# EAGLE design serializer (EAGLE 6.6.0)
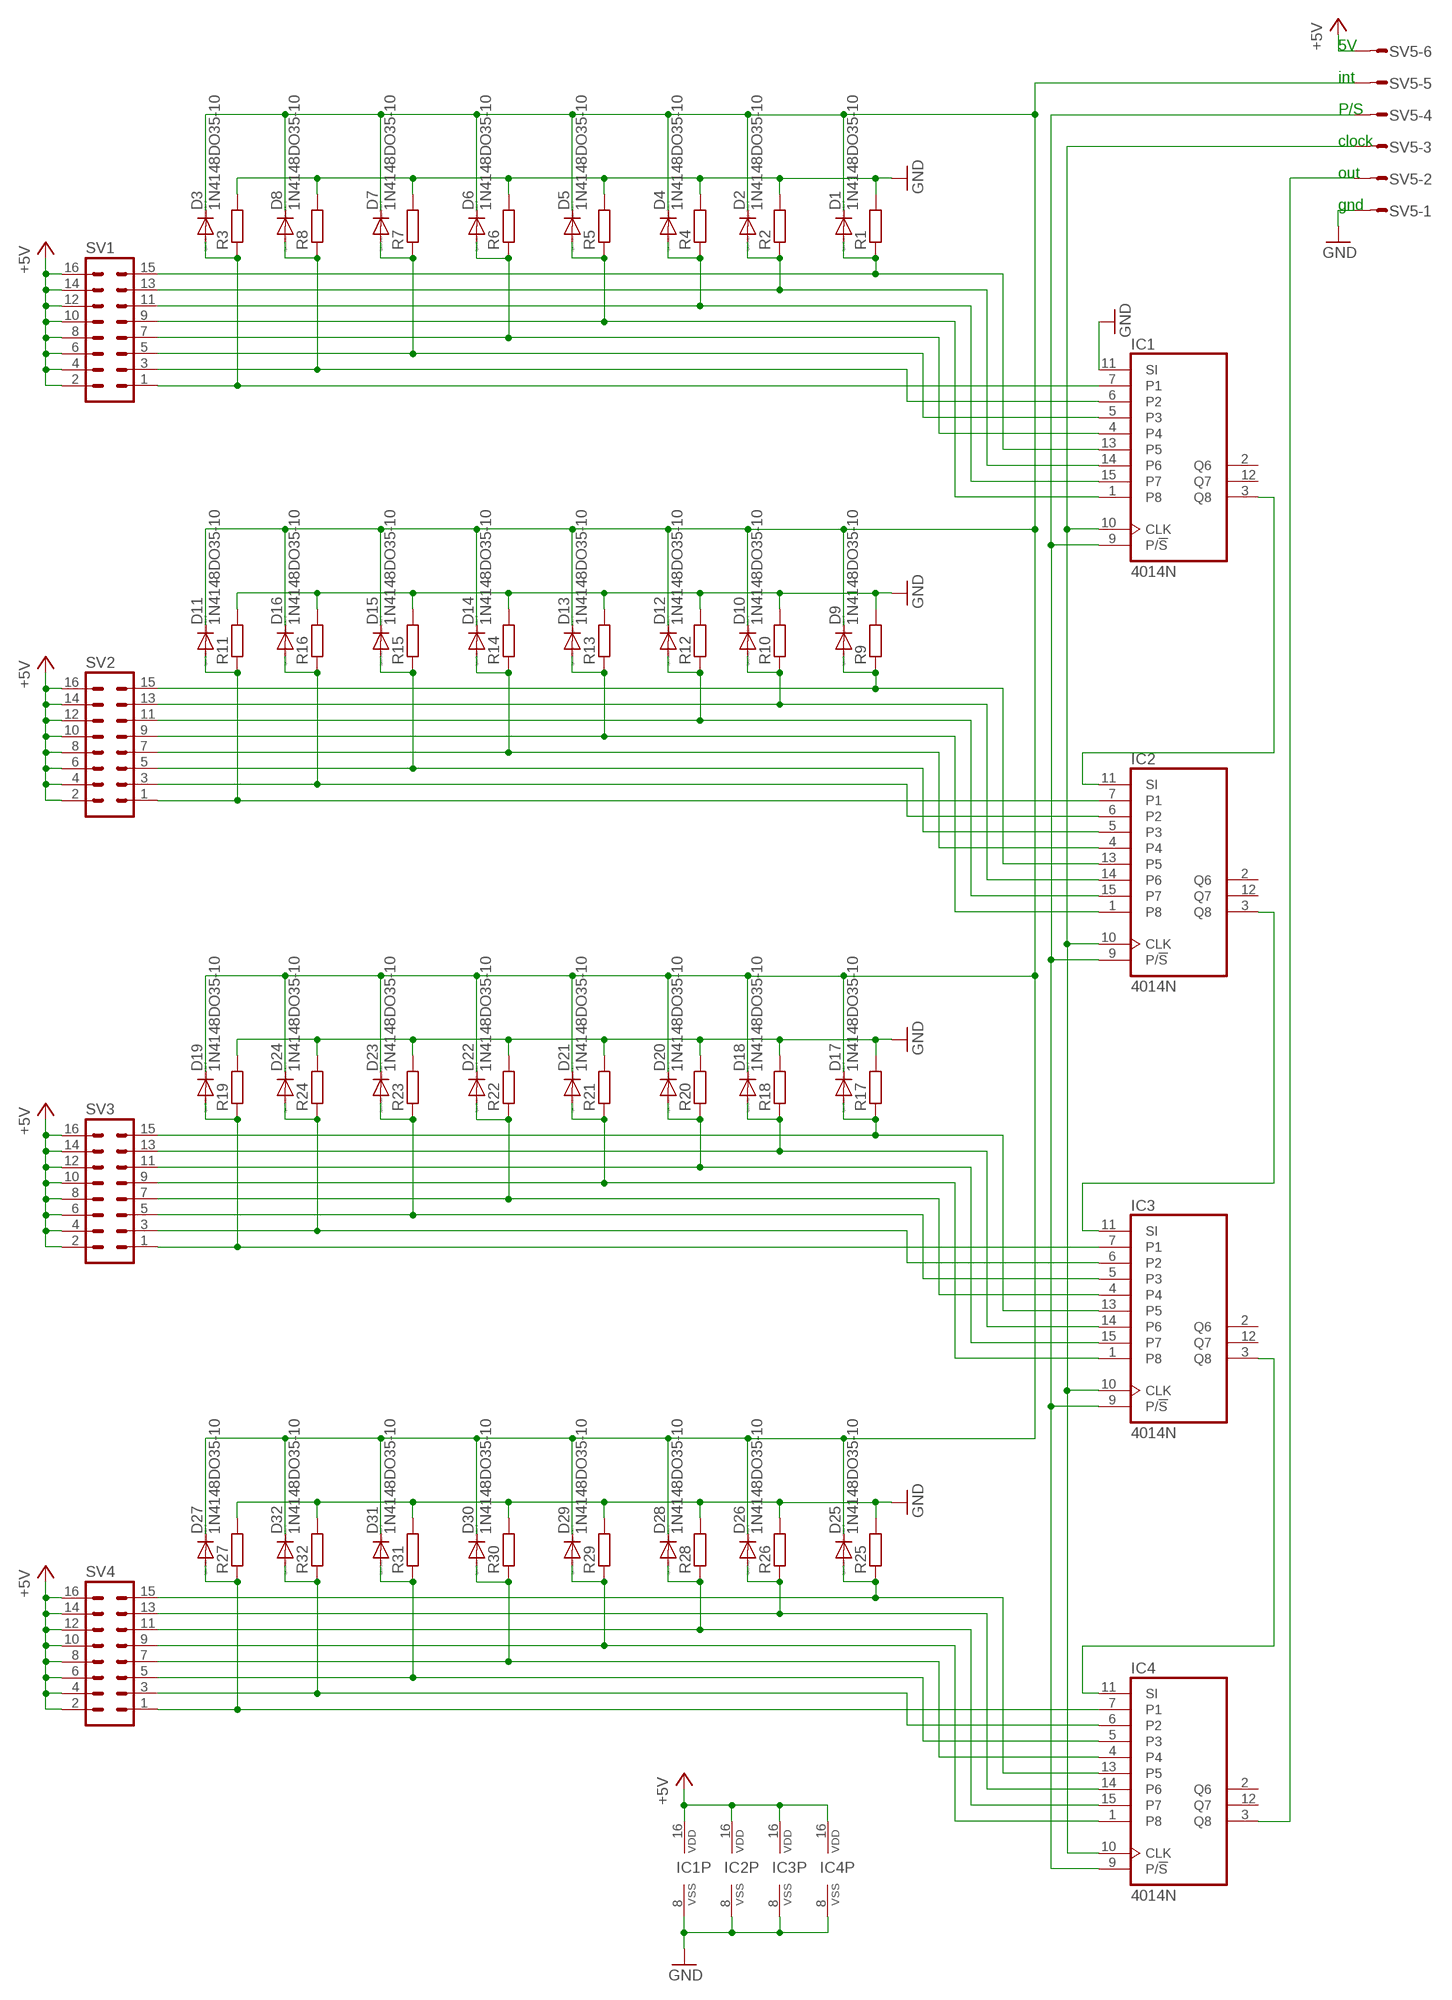
[diagram p0: schematic, sheet 1]

## Parts
D1  1N4148DO35-10  [DO35-10]
D2  1N4148DO35-10  [DO35-10]
D3  1N4148DO35-10  [DO35-10]
D4  1N4148DO35-10  [DO35-10]
D5  1N4148DO35-10  [DO35-10]
D6  1N4148DO35-10  [DO35-10]
D7  1N4148DO35-10  [DO35-10]
D8  1N4148DO35-10  [DO35-10]
D9  1N4148DO35-10  [DO35-10]
D10  1N4148DO35-10  [DO35-10]
D11  1N4148DO35-10  [DO35-10]
D12  1N4148DO35-10  [DO35-10]
D13  1N4148DO35-10  [DO35-10]
D14  1N4148DO35-10  [DO35-10]
D15  1N4148DO35-10  [DO35-10]
D16  1N4148DO35-10  [DO35-10]
D17  1N4148DO35-10  [DO35-10]
D18  1N4148DO35-10  [DO35-10]
D19  1N4148DO35-10  [DO35-10]
D20  1N4148DO35-10  [DO35-10]
D21  1N4148DO35-10  [DO35-10]
D22  1N4148DO35-10  [DO35-10]
D23  1N4148DO35-10  [DO35-10]
D24  1N4148DO35-10  [DO35-10]
D25  1N4148DO35-10  [DO35-10]
D26  1N4148DO35-10  [DO35-10]
D27  1N4148DO35-10  [DO35-10]
D28  1N4148DO35-10  [DO35-10]
D29  1N4148DO35-10  [DO35-10]
D30  1N4148DO35-10  [DO35-10]
D31  1N4148DO35-10  [DO35-10]
D32  1N4148DO35-10  [DO35-10]
IC1  4014N  [DIL16]
IC2  4014N  [DIL16]
IC3  4014N  [DIL16]
IC4  4014N  [DIL16]
R1  R-EU_M1206  [M1206]
R2  R-EU_M1206  [M1206]
R3  R-EU_M1206  [M1206]
R4  R-EU_M1206  [M1206]
R5  R-EU_M1206  [M1206]
R6  R-EU_M1206  [M1206]
R7  R-EU_M1206  [M1206]
R8  R-EU_M1206  [M1206]
R9  R-EU_M1206  [M1206]
R10  R-EU_M1206  [M1206]
R11  R-EU_M1206  [M1206]
R12  R-EU_M1206  [M1206]
R13  R-EU_M1206  [M1206]
R14  R-EU_M1206  [M1206]
R15  R-EU_M1206  [M1206]
R16  R-EU_M1206  [M1206]
R17  R-EU_M1206  [M1206]
R18  R-EU_M1206  [M1206]
R19  R-EU_M1206  [M1206]
R20  R-EU_M1206  [M1206]
R21  R-EU_M1206  [M1206]
R22  R-EU_M1206  [M1206]
R23  R-EU_M1206  [M1206]
R24  R-EU_M1206  [M1206]
R25  R-EU_M1206  [M1206]
R26  R-EU_M1206  [M1206]
R27  R-EU_M1206  [M1206]
R28  R-EU_M1206  [M1206]
R29  R-EU_M1206  [M1206]
R30  R-EU_M1206  [M1206]
R31  R-EU_M1206  [M1206]
R32  R-EU_M1206  [M1206]
SV1  MA08-2  [MA08-2]
SV2  MA08-2  [MA08-2]
SV3  MA08-2  [MA08-2]
SV4  MA08-2  [MA08-2]
SV5  S06P  [S06P]

## Nets
+5V: IC1.16(VDD) IC2.16(VDD) IC3.16(VDD) IC4.16(VDD) SV1.2 SV1.4 SV1.6 SV1.8 SV1.10 SV1.12 SV1.14 SV1.16 SV2.2 SV2.4 SV2.6 SV2.8 SV2.10 SV2.12 SV2.14 SV2.16 SV3.2 SV3.4 SV3.6 SV3.8 SV3.10 SV3.12 SV3.14 SV3.16 SV4.2 SV4.4 SV4.6 SV4.8 SV4.10 SV4.12 SV4.14 SV4.16 SV5.6
GND: IC1.8(VSS) IC1.11(SI) IC2.8(VSS) IC3.8(VSS) IC4.8(VSS) R1.2 R2.2 R3.2 R4.2 R5.2 R6.2 R7.2 R8.2 R9.2 R10.2 R11.2 R12.2 R13.2 R14.2 R15.2 R16.2 R17.2 R18.2 R19.2 R20.2 R21.2 R22.2 R23.2 R24.2 R25.2 R26.2 R27.2 R28.2 R29.2 R30.2 R31.2 R32.2 SV5.1
N$1: D1.A IC1.13(P5) R1.1 SV1.15
N$2: D2.A IC1.14(P6) R2.1 SV1.13
N$3: D9.A IC2.13(P5) R9.1 SV2.15
N$4: D10.A IC2.14(P6) R10.1 SV2.13
N$6: D11.A IC2.7(P1) R11.1 SV2.1
N$7: D12.A IC2.15(P7) R12.1 SV2.11
N$8: D13.A IC2.1(P8) R13.1 SV2.9
N$9: D14.A IC2.4 R14.1 SV2.7
N$10: D15.A IC2.5(P3) R15.1 SV2.5
N$11: D16.A IC2.6(P2) R16.1 SV2.3
N$12: IC2.3(Q8) IC3.11(SI)
N$13: IC1.10(CLK) IC2.10(CLK) IC3.10(CLK) IC4.10(CLK) SV5.3
N$15: D17.A IC3.13(P5) R17.1 SV3.15
N$16: D18.A IC3.14(P6) R18.1 SV3.13
N$17: D1.C D2.C D3.C D4.C D5.C D6.C D7.C D8.C D9.C D10.C D11.C D12.C D13.C D14.C D15.C D16.C D17.C D18.C D19.C D20.C D21.C D22.C D23.C D24.C D25.C D26.C D27.C D28.C D29.C D30.C D31.C D32.C SV5.5
N$18: D19.A IC3.7(P1) R19.1 SV3.1
N$19: D20.A IC3.15(P7) R20.1 SV3.11
N$20: D21.A IC3.1(P8) R21.1 SV3.9
N$21: D22.A IC3.4 R22.1 SV3.7
N$22: D23.A IC3.5(P3) R23.1 SV3.5
N$23: D24.A IC3.6(P2) R24.1 SV3.3
N$24: IC3.3(Q8) IC4.11(SI)
N$27: D25.A IC4.13(P5) R25.1 SV4.15
N$28: D26.A IC4.14(P6) R26.1 SV4.13
N$30: D27.A IC4.7(P1) R27.1 SV4.1
N$31: D28.A IC4.15(P7) R28.1 SV4.11
N$32: D29.A IC4.1(P8) R29.1 SV4.9
N$33: D30.A IC4.4 R30.1 SV4.7
N$34: D31.A IC4.5(P3) R31.1 SV4.5
N$35: D32.A IC4.6(P2) R32.1 SV4.3
N$36: IC4.3(Q8) SV5.2
N$39: D3.A IC1.7(P1) R3.1 SV1.1
N$40: IC1.9(P/!S) IC2.9(P/!S) IC3.9(P/!S) IC4.9(P/!S) SV5.4
N$41: D4.A IC1.15(P7) R4.1 SV1.11
N$43: D5.A IC1.1(P8) R5.1 SV1.9
N$45: D6.A IC1.4 R6.1 SV1.7
N$47: D7.A IC1.5(P3) R7.1 SV1.5
N$49: D8.A IC1.6(P2) R8.1 SV1.3
N$51: IC1.3(Q8) IC2.11(SI)
Unconnected: IC1.2(Q6) IC1.12(Q7) IC2.2(Q6) IC2.12(Q7) IC3.2(Q6) IC3.12(Q7) IC4.2(Q6) IC4.12(Q7)

## Notes on the sheet
- 5V
- int
- P/S
- clock
- out
- gnd

## Library data of the parts
D1-D32 = diode:1N4148: DIODE high speed (Philips)
IC1-IC4 = 40xx:4014: 8-bit static SHIFT REGISTER
R1-R32 = resistor:R-EU_: RESISTOR, European symbol
SV1-SV4 = con-lstb:MA08-2: PIN HEADER; OC_FARNELL: unknown; OC_NEWARK: unknown
SV5 = con-amp-mt:S06P: AMP MT CONNECTOR; OC_FARNELL: unknown; OC_NEWARK: unknown

## Board
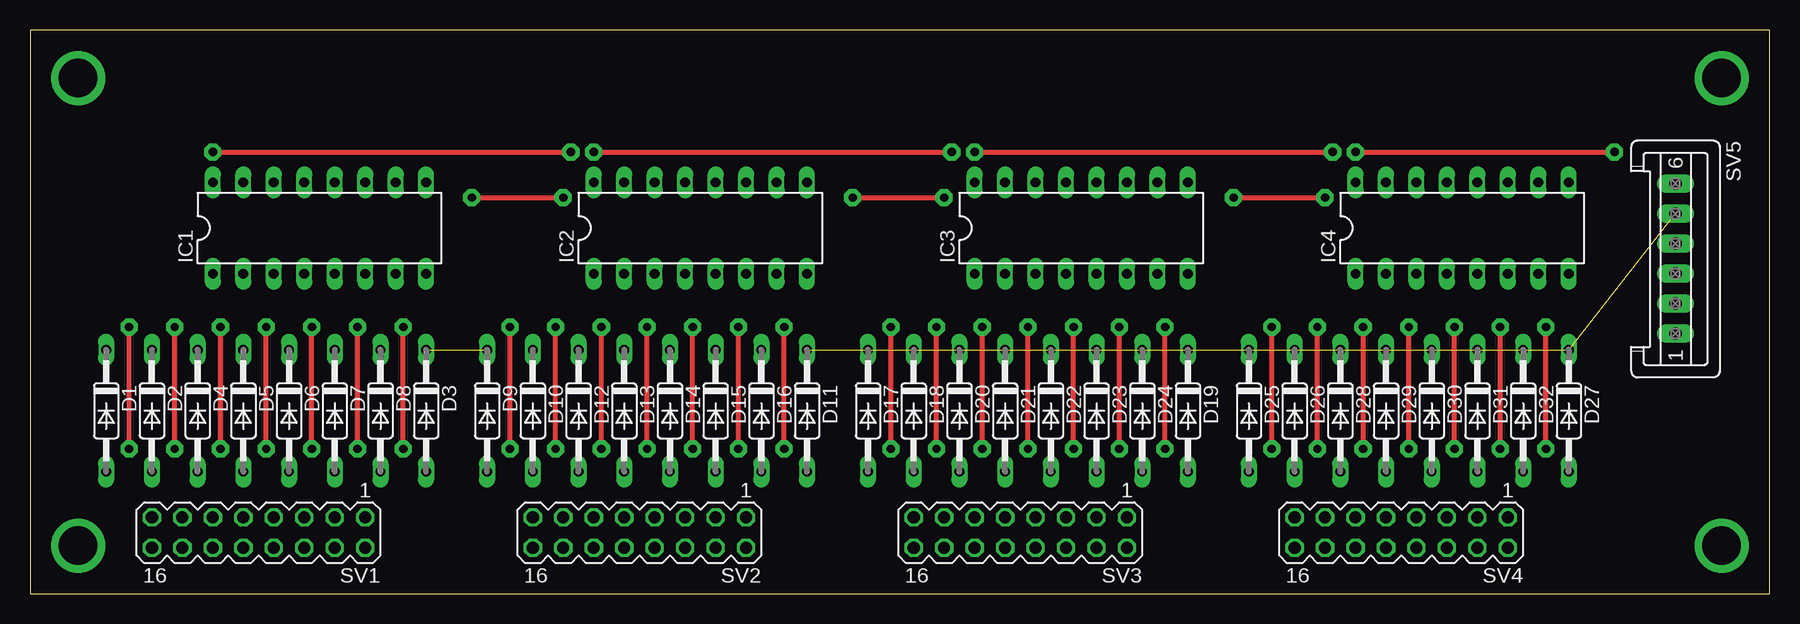
[diagram p1: board, top side]
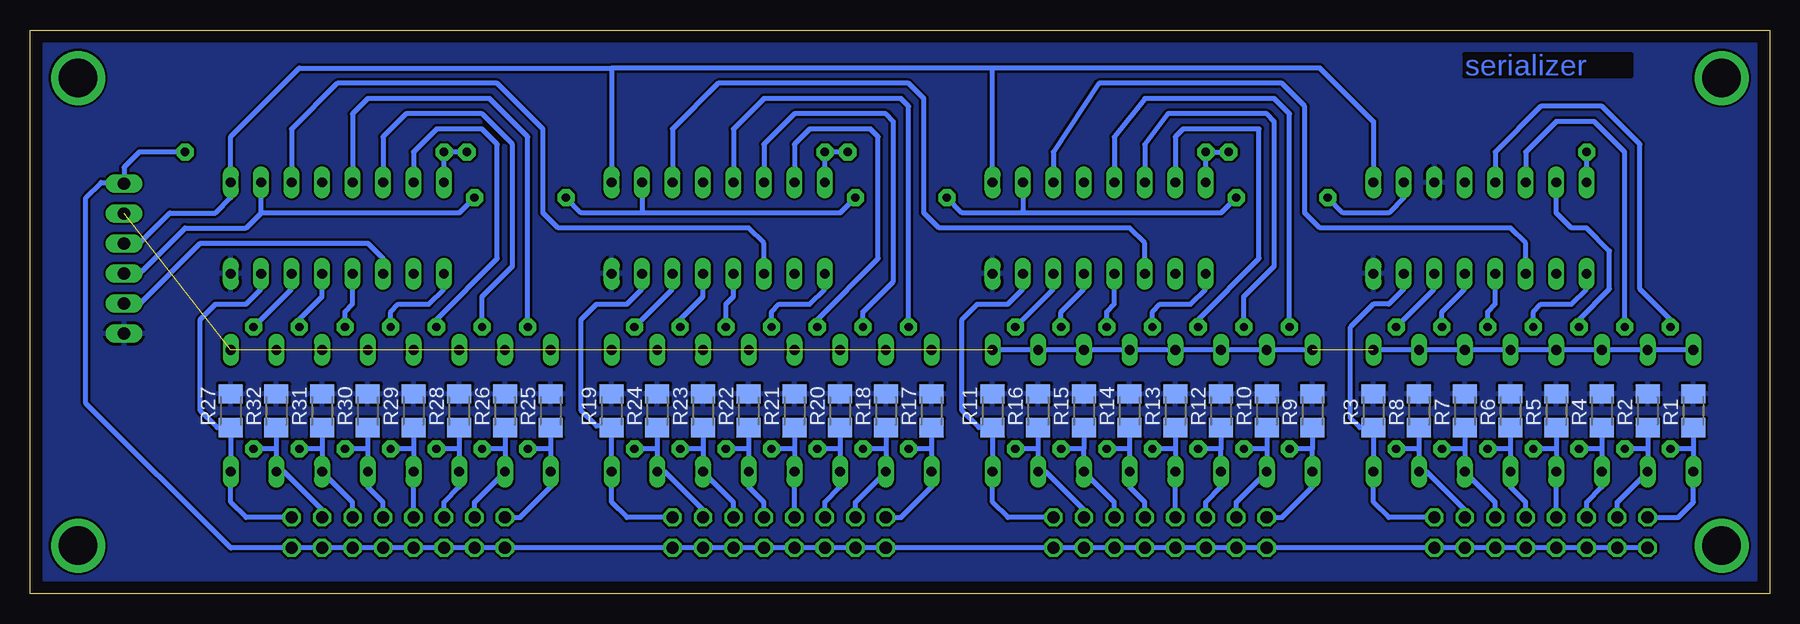
[diagram p2: board, bottom side, seen from below]

Size 145 x 47 mm. Coordinates in mm from the lower left corner, seen from the top.
Outline: 0,0 145,0 145,47 0,47 0,0
Copper layers (1*16): Top 0.035mm / dielectric 1.5mm / Bottom 0.035mm
Design rules "default": minimum track width 10mil, minimum drill 24mil, track to track 8mil, track to pad 8mil, pad to pad 8mil, via to via 8mil, smd to smd 8mil, copper to edge 40mil, drill to drill 8mil, minimum pad ring 10mil, minimum via ring 8mil, stop-mask expansion 4mil, vias tented up to drill 0mil, thermal gap 10mil

### Footprints (pad centres in the part's own frame; a part is rotated, then mirrored left to right if it is on the bottom)
DO35-10 = drill 0.813 long: A 5.08,0; C -5.08,0
DIL16 = drill 0.813 long: 1 -8.89,-3.81; 2 -6.35,-3.81; 3 -3.81,-3.81; 4 -1.27,-3.81; 5 1.27,-3.81; 6 3.81,-3.81; 7 6.35,-3.81; 8 8.89,-3.81; 9 8.89,3.81; 10 6.35,3.81; 11 3.81,3.81; 12 1.27,3.81; 13 -1.27,3.81; 14 -3.81,3.81; 15 -6.35,3.81; 16 -8.89,3.81
M1206 = smd 1.6 x 2: 1 -1.4,0; 2 1.4,0
MA08-2 = drill 1.016 octagon: 1 -8.89,-1.27; 2 -8.89,1.27; 3 -6.35,-1.27; 4 -6.35,1.27; 5 -3.81,-1.27; 6 -3.81,1.27; 7 -1.27,-1.27; 8 -1.27,1.27; 9 1.27,-1.27; 10 1.27,1.27; 11 3.81,-1.27; 12 3.81,1.27; 13 6.35,-1.27; 14 6.35,1.27; 15 8.89,-1.27; 16 8.89,1.27
S06P = drill 1.016 long: 1 6.25,0; 2 3.75,0; 3 1.25,0; 4 -1.25,0; 5 -3.75,0; 6 -6.25,0

### Placement (x,y rotation side)
D1  6.35,15.24 270 top
D2  10.16,15.24 270 top
D3  33.02,15.24 270 top
D4  13.97,15.24 270 top
D5  17.78,15.24 270 top
D6  21.59,15.24 270 top
D7  25.4,15.24 270 top
D8  29.21,15.24 270 top
D9  38.1,15.24 270 top
D10  41.91,15.24 270 top
D11  64.77,15.24 270 top
D12  45.72,15.24 270 top
D13  49.53,15.24 270 top
D14  53.34,15.24 270 top
D15  57.15,15.24 270 top
D16  60.96,15.24 270 top
D17  69.85,15.24 270 top
D18  73.66,15.24 270 top
D19  96.52,15.24 270 top
D20  77.47,15.24 270 top
D21  81.28,15.24 270 top
D22  85.09,15.24 270 top
D23  88.9,15.24 270 top
D24  92.71,15.24 270 top
D25  101.6,15.24 270 top
D26  105.41,15.24 270 top
D27  128.27,15.24 270 top
D28  109.22,15.24 270 top
D29  113.03,15.24 270 top
D30  116.84,15.24 270 top
D31  120.65,15.24 270 top
D32  124.46,15.24 270 top
IC1  24.13,30.48 0 top
IC2  55.88,30.48 0 top
IC3  87.63,30.48 0 top
IC4  119.38,30.48 0 top
R1  6.35,15.24 90 bottom
R2  10.16,15.24 90 bottom
R3  33.02,15.24 90 bottom
R4  13.97,15.24 90 bottom
R5  17.78,15.24 90 bottom
R6  21.59,15.24 90 bottom
R7  25.4,15.24 90 bottom
R8  29.21,15.24 90 bottom
R9  38.1,15.24 90 bottom
R10  41.91,15.24 90 bottom
R11  64.77,15.24 90 bottom
R12  45.72,15.24 90 bottom
R13  49.53,15.24 90 bottom
R14  53.34,15.24 90 bottom
R15  57.15,15.24 90 bottom
R16  60.96,15.24 90 bottom
R17  69.85,15.24 90 bottom
R18  73.66,15.24 90 bottom
R19  96.52,15.24 90 bottom
R20  77.47,15.24 90 bottom
R21  81.28,15.24 90 bottom
R22  85.09,15.24 90 bottom
R23  88.9,15.24 90 bottom
R24  92.71,15.24 90 bottom
R25  101.6,15.24 90 bottom
R26  105.41,15.24 90 bottom
R27  128.27,15.24 90 bottom
R28  109.22,15.24 90 bottom
R29  113.03,15.24 90 bottom
R30  116.84,15.24 90 bottom
R31  120.65,15.24 90 bottom
R32  124.46,15.24 90 bottom
SV1  19.05,5.08 180 top
SV2  50.8,5.08 180 top
SV3  82.55,5.08 180 top
SV4  114.3,5.08 180 top
SV5  137.16,27.94 270 top

### Tracks (layer width: path | path; a pad name or v marks a point on that pad's centre or on a via)
+5V  (via drill 0.7 pad 1.42)
  Top 0.406: v15.24,36.83 v45.09,36.83 | v46.99,36.83 v76.83,36.83 | v78.74,36.83 v108.58,36.83 | v110.49,36.83 v132.08,36.83
  Bottom 0.406: SV1.16 SV1.14 SV1.12 SV1.10 SV1.8 SV1.6 SV1.4 SV1.2 SV2.16 SV2.14 SV2.12 SV2.10 SV2.8 SV2.6 SV2.4 SV2.2 SV3.16 SV3.14 SV3.12 SV3.10 SV3.8 SV3.6 SV3.4 SV3.2 SV4.16 SV4.14 SV4.12 SV4.10 SV4.8 SV4.6 SV4.4 SV4.2 128.27,3.81 140.34,15.88 140.34,33.02 139.06,34.29 137.26,34.29 SV5.6 137.16,35.56 135.89,36.83 v132.08,36.83 | IC1.16 v15.24,36.83 | v45.09,36.83 v46.99,36.83 IC2.16 | v76.83,36.83 v78.74,36.83 IC3.16 | v108.58,36.83 v110.49,36.83 IC4.16
GND
  pour Bottom: 0,0 145,0 145.02,47.33 0,47.33
N$1  (via drill 0.7 pad 1.42)
  Top 0.406: v8.26,12.06 v8.26,22.23
  Bottom 0.406: SV1.15 7.62,6.35 6.35,7.62 D1.A 6.35,12.06 | R1.1 6.35,12.06 | 6.35,12.06 v8.26,12.06 | v8.26,22.23 8.26,22.86 10.79,25.4 10.79,37.47 13.97,40.64 19.05,40.64 22.86,36.83 IC1.13
N$2  (via drill 0.7 pad 1.42)
  Top 0.406: v12.06,12.06 v12.06,22.23
  Bottom 0.406: SV1.13 12.7,7.62 D2.A 10.16,12.06 | R2.1 10.16,12.06 | 10.16,12.06 v12.06,12.06 | v12.06,22.23 12.06,36.83 14.61,39.37 17.78,39.37 20.32,36.83 IC1.14
N$3  (via drill 0.7 pad 1.42)
  Top 0.406: v40.01,12.06 v40.01,22.23
  Bottom 0.406: 38.1,12.06 D9.A 38.1,8.89 40.64,6.35 SV2.15 | R9.1 38.1,12.06 | 38.1,12.06 v40.01,12.06 | v40.01,22.23 40.01,40.01 41.27,41.27 52.07,41.27 54.61,38.1 IC2.13
N$4  (via drill 0.7 pad 1.42)
  Top 0.406: v43.81,12.06 v43.81,22.23
  Bottom 0.406: SV2.13 44.45,7.62 D10.A 41.91,12.06 | R10.1 41.91,12.06 | 41.91,12.06 v43.81,12.06 | IC2.14 52.07,37.47 50.16,40.01 41.91,40.01 41.27,39.37 41.27,27.3 43.81,24.77 v43.81,22.23
N$5  (via drill 3.2 pad 4.5)
  other vias: 4,4
N$6
  Bottom 0.406: SV2.1 63.5,6.35 64.77,7.62 D11.A R11.1 65.91,13.84 67.31,15.24 67.31,22.86 66.04,24.13 63.5,24.13 62.23,25.4 IC2.7
N$7  (via drill 0.7 pad 1.42)
  Top 0.406: v47.62,12.06 v47.62,22.23
  Bottom 0.406: SV2.11 46.99,7.62 45.72,8.89 D12.A 45.72,12.06 | R12.1 45.72,12.06 | 45.72,12.06 v47.62,12.06 | v47.62,22.23 47.62,22.86 42.55,27.94 42.55,38.73 48.9,38.73 49.53,38.1 IC2.15
N$8  (via drill 0.7 pad 1.42)
  Top 0.406: v51.44,12.06 v51.44,22.23
  Bottom 0.406: SV2.9 D13.A 49.53,12.06 | R13.1 49.53,12.06 | 49.53,12.06 v51.44,12.06 | v51.44,22.23 51.44,23.5 50.8,24.13 48.26,24.13 46.99,25.4 IC2.1
N$9  (via drill 0.7 pad 1.42)
  Top 0.406: v55.24,12.06 v55.24,22.23
  Bottom 0.406: SV2.7 52.07,7.62 53.34,8.89 D14.A 53.34,12.06 | R14.1 53.34,12.06 | 53.34,12.06 v55.24,12.06 | v55.24,22.23 55.24,23.5 54.61,24.13 IC2.4
N$10  (via drill 0.7 pad 1.42)
  Top 0.406: v59.05,12.06 v59.05,22.23
  Bottom 0.406: SV2.5 54.61,7.62 D15.A 57.15,12.06 | R15.1 57.15,12.06 | 57.15,12.06 v59.05,12.06 | v59.05,22.23 59.05,23.5 57.15,25.4 IC2.5
N$11  (via drill 0.7 pad 1.42)
  Top 0.406: v62.87,12.06 v62.87,22.23
  Bottom 0.406: SV2.3 57.15,6.99 60.33,10.16 D16.A 60.96,12.06 | R16.1 60.96,12.06 | 60.96,12.06 v62.87,12.06 | v62.87,22.23 59.69,25.4 IC2.6
N$12
  Bottom 0.406: IC2.3 52.07,29.21 53.34,30.48 69.22,30.48 70.48,31.75 70.48,41.27 71.75,42.55 87.63,42.55 91.44,38.73 IC3.11
N$13  (via drill 0.7 pad 1.42)
  Top 0.406: v36.83,33.02 v44.45,33.02 | v68.58,33.02 v76.2,33.02 | v100.33,33.02 v107.95,33.02
  Bottom 0.406: IC1.10 30.48,33.02 31.75,31.75 35.56,31.75 v36.83,33.02 | v44.45,33.02 45.72,31.75 62.23,31.75 | IC2.10 62.23,31.75 | 62.23,31.75 67.31,31.75 v68.58,33.02 | v76.2,33.02 77.47,31.75 93.98,31.75 | IC3.10 93.98,31.75 | 93.98,31.75 99.06,31.75 v100.33,33.02 | v107.95,33.02 109.22,31.75 125.73,31.75 | 125.73,31.75 IC4.10 | SV5.3 135.87,26.69 132.08,30.48 127,30.48 125.73,31.75
N$14  (via drill 3.2 pad 4.5)
  other vias: 4,43
N$15  (via drill 0.7 pad 1.42)
  Top 0.406: v71.75,12.06 v71.75,22.23
  Bottom 0.406: SV3.15 72.39,6.35 69.85,8.89 D17.A 69.85,12.06 | R17.1 69.85,12.06 | 69.85,12.06 v71.75,12.06 | v71.75,22.23 71.75,40.64 72.39,41.27 83.82,41.27 86.36,38.73 IC3.13
N$16  (via drill 0.7 pad 1.42)
  Top 0.406: v75.56,12.06 v75.56,22.23
  Bottom 0.406: SV3.13 76.2,7.62 D18.A 73.66,12.06 | R18.1 73.66,12.06 | 73.66,12.06 v75.56,12.06 | v75.56,22.23 75.56,23.5 73.03,26.04 73.03,39.37 73.66,40.01 81.28,40.01 83.82,37.47 IC3.14
N$17  (18 unrouted)
  Bottom 0.406: D1.C D2.C D4.C D5.C D6.C D7.C D8.C D3.C | D9.C D10.C D12.C D13.C D14.C D15.C D16.C D11.C
N$18
  Bottom 0.406: SV3.1 95.25,6.35 96.52,7.62 D19.A R19.1 96.52,13.97 97.79,13.97 99.06,15.24 99.06,22.86 97.79,24.13 95.25,24.13 93.98,25.4 IC3.7
N$19  (via drill 0.7 pad 1.42)
  Top 0.406: v79.38,12.06 v79.38,22.23
  Bottom 0.406: SV3.11 78.74,7.62 77.47,8.89 D20.A 77.47,12.06 | R20.1 77.47,12.06 | 77.47,12.06 v79.38,12.06 | v79.38,22.23 79.38,22.86 74.3,27.94 74.3,38.1 74.93,38.73 80.01,38.73 81.28,37.47 IC3.15
N$20  (via drill 0.7 pad 1.42)
  Top 0.406: v83.19,12.06 v83.19,22.23
  Bottom 0.406: SV3.9 D21.A 81.28,12.06 | R21.1 81.28,12.06 | 81.28,12.06 v83.19,12.06 | v83.19,22.23 83.19,23.5 82.55,24.13 80.01,24.13 78.74,25.4 IC3.1
N$21  (via drill 0.7 pad 1.42)
  Top 0.406: v87,12.06 v87,22.23
  Bottom 0.406: SV3.7 83.82,7.62 85.09,8.89 D22.A 85.09,12.06 | R22.1 85.09,12.06 | 85.09,12.06 v87,12.06 | v87,22.23 87,24.13 86.36,24.77 IC3.4
N$22  (via drill 0.7 pad 1.42)
  Top 0.406: v90.81,12.06 v90.81,22.23
  Bottom 0.406: SV3.5 86.36,7.62 D23.A 88.9,12.06 | R23.1 88.9,12.06 | 88.9,12.06 v90.81,12.06 | v90.81,22.23 90.81,22.86 88.9,24.77 IC3.5
N$23  (via drill 0.7 pad 1.42)
  Top 0.406: v94.61,12.06 v94.61,22.23
  Bottom 0.406: SV3.3 88.9,6.99 92.08,10.16 D24.A 92.71,12.06 | R24.1 92.71,12.06 | 92.71,12.06 v94.61,12.06 | v94.61,22.23 91.44,25.4 IC3.6
N$24
  Bottom 0.406: IC3.3 83.82,29.21 85.09,30.48 100.97,30.48 102.23,31.75 102.23,38.73 106.05,42.55 119.38,42.55 123.19,38.73 IC4.11
N$25  (via drill 3.2 pad 4.5)
  other vias: 141,43
N$26  (via drill 3.2 pad 4.5)
  other vias: 141,4
N$27  (via drill 0.7 pad 1.42)
  Top 0.406: v103.5,12.06 v103.5,22.23
  Bottom 0.406: SV4.15 104.14,6.35 101.6,8.89 D25.A 101.6,12.06 | R25.1 101.6,12.06 | 101.6,12.06 v103.5,12.06 | v103.5,22.23 103.5,38.1 106.68,41.27 116.84,41.27 118.11,40.01 IC4.13
N$28  (via drill 0.7 pad 1.42)
  Top 0.406: v107.31,12.06 v107.31,22.23
  Bottom 0.406: SV4.13 107.95,7.62 D26.A 105.41,12.06 | R26.1 105.41,12.06 | 105.41,12.06 v107.31,12.06 | v107.31,22.23 107.31,24.77 104.78,27.3 104.78,37.47 107.31,40.01 113.67,40.01 115.57,38.1 IC4.14
N$29  (via drill 0.7 pad 1.42)
  other vias: 71.75,12.06
N$30
  Bottom 0.406: SV4.1 127,6.35 128.27,7.62 D27.A R27.1 129.41,13.84 130.81,15.24 130.81,22.86 129.54,24.13 127,24.13 125.73,25.4 IC4.7
N$31  (via drill 0.7 pad 1.42)
  Top 0.406: v111.12,12.06 v111.12,22.23
  Bottom 0.406: SV4.11 110.49,7.62 109.22,8.89 D28.A 109.22,12.06 | R28.1 109.22,12.06 | 109.22,12.06 v111.12,12.06 | v111.12,22.23 111.12,22.86 106.05,27.94 106.05,37.47 107.31,38.73 111.12,38.73 113.03,36.83 IC4.15
N$32  (via drill 0.7 pad 1.42)
  Top 0.406: v114.94,12.06 v114.94,22.23
  Bottom 0.406: SV4.9 D29.A 113.03,12.06 | R29.1 113.03,12.06 | 113.03,12.06 v114.94,12.06 | v114.94,22.23 114.94,23.5 114.3,24.13 111.76,24.13 110.49,25.4 IC4.1
N$33  (via drill 0.7 pad 1.42)
  Top 0.406: v118.75,12.06 v118.75,22.23
  Bottom 0.406: SV4.7 115.57,7.62 116.84,8.89 D30.A 116.84,12.06 | R30.1 116.84,12.06 | 116.84,12.06 v118.75,12.06 | v118.75,22.23 118.75,23.5 118.11,24.13 IC4.4
N$34  (via drill 0.7 pad 1.42)
  Top 0.406: v122.56,12.06 v122.56,22.23
  Bottom 0.406: SV4.5 118.11,7.62 D31.A 120.65,12.06 | R31.1 120.65,12.06 | 120.65,12.06 v122.56,12.06 | v122.56,22.23 122.56,22.86 120.65,24.77 IC4.5
N$35  (via drill 0.7 pad 1.42)
  Top 0.406: v126.36,12.06 v126.36,22.23
  Bottom 0.406: SV4.3 120.65,6.99 123.83,10.16 D32.A 124.46,12.06 | R32.1 124.46,12.06 | 124.46,12.06 v126.36,12.06 | v126.36,22.23 123.19,25.4 IC4.6
N$36
  Bottom 0.406: SV5.2 135.83,24.19 130.81,29.21 116.84,29.21 115.57,27.94 IC4.3
N$39
  Bottom 0.406: SV1.1 31.75,6.35 33.02,7.62 D3.A R3.1 34.16,13.84 34.92,14.61 34.92,22.23 33.02,24.13 31.75,24.13 30.48,25.4 IC1.7
N$40
  Bottom 0.406: 64.77,43.81 37.47,43.81 33.02,39.37 IC1.9 | IC2.9 64.77,43.81 | 64.77,43.81 96.52,43.81 | 96.52,43.81 IC3.9 | SV5.4 135.91,29.19 133.35,31.75 129.54,31.75 128.27,33.02 IC4.9 128.27,38.1 122.56,43.81 96.52,43.81
N$41  (via drill 0.7 pad 1.42)
  Top 0.406: v15.88,12.06 v15.88,22.23
  Bottom 0.406: SV1.11 15.24,7.62 13.97,8.89 D4.A 13.97,12.06 | R4.1 13.97,12.06 | 13.97,12.06 v15.88,12.06 | v15.88,22.23 15.88,22.86 13.34,25.4 13.34,28.57 15.24,30.48 16.51,30.48 17.78,31.75 IC1.15
N$42  (via drill 0.7 pad 1.42)
  other vias: 75.56,12.06
N$43  (via drill 0.7 pad 1.42)
  Top 0.406: v19.68,12.06 v19.68,22.23
  Bottom 0.406: SV1.9 D5.A 17.78,12.06 | R5.1 17.78,12.06 | 17.78,12.06 v19.68,12.06 | v19.68,22.23 19.68,23.5 19.05,24.13 16.51,24.13 15.24,25.4 IC1.1
N$44  (via drill 0.7 pad 1.42)
  other vias: 79.38,12.06
N$45  (via drill 0.7 pad 1.42)
  Top 0.406: v23.5,12.06 v23.5,22.23
  Bottom 0.406: SV1.7 20.32,7.62 21.59,8.89 D6.A 21.59,12.06 | R6.1 21.59,12.06 | 21.59,12.06 v23.5,12.06 | v23.5,22.23 23.5,23.5 22.86,24.13 IC1.4
N$46  (via drill 0.7 pad 1.42)
  other vias: 83.19,12.06
N$47  (via drill 0.7 pad 1.42)
  Top 0.406: v27.3,12.06 v27.3,22.23
  Bottom 0.406: SV1.5 22.86,7.62 D7.A 25.4,12.06 | R7.1 25.4,12.06 | 25.4,12.06 v27.3,12.06 | v27.3,22.23 27.3,23.5 25.4,25.4 IC1.5
N$48  (via drill 0.7 pad 1.42)
  other vias: 87,12.06
N$49  (via drill 0.7 pad 1.42)
  Top 0.406: v31.11,12.06 v31.11,22.23
  Bottom 0.406: SV1.3 25.4,6.99 28.57,10.16 D8.A 29.21,12.06 | R8.1 29.21,12.06 | 29.21,12.06 v31.11,12.06 | v31.11,22.23 27.94,25.4 IC1.6
N$50  (via drill 0.7 pad 1.42)
  other vias: 90.81,12.06
N$51
  Bottom 0.406: IC1.3 20.32,29.21 21.59,30.48 37.47,30.48 38.73,31.75 38.73,40.64 40.64,42.55 55.88,42.55 59.69,36.83 IC2.11
N$52  (via drill 0.7 pad 1.42)
  other vias: 94.61,12.06
N$58  (via drill 0.7 pad 1.42)
  other vias: 40.01,12.06
N$59  (via drill 0.7 pad 1.42)
  other vias: 43.81,12.06
N$60  (via drill 0.7 pad 1.42)
  other vias: 47.62,12.06
N$61  (via drill 0.7 pad 1.42)
  other vias: 51.44,12.06
N$62  (via drill 0.7 pad 1.42)
  other vias: 55.24,12.06
N$63  (via drill 0.7 pad 1.42)
  other vias: 59.05,12.06
N$64  (via drill 0.7 pad 1.42)
  other vias: 62.87,12.06
N$65  (via drill 0.7 pad 1.42)
  other vias: 40.01,22.23
N$66  (via drill 0.7 pad 1.42)
  other vias: 43.81,22.23
N$67  (via drill 0.7 pad 1.42)
  other vias: 47.62,22.23
N$68  (via drill 0.7 pad 1.42)
  other vias: 51.44,22.23
N$69  (via drill 0.7 pad 1.42)
  other vias: 55.24,22.23
N$70  (via drill 0.7 pad 1.42)
  other vias: 59.05,22.23
N$71  (via drill 0.7 pad 1.42)
  other vias: 62.87,22.23
N$72  (via drill 0.7 pad 1.42)
  other vias: 8.26,12.06
N$73  (via drill 0.7 pad 1.42)
  other vias: 12.06,12.06
N$74  (via drill 0.7 pad 1.42)
  other vias: 15.88,12.06
N$75  (via drill 0.7 pad 1.42)
  other vias: 19.68,12.06
N$76  (via drill 0.7 pad 1.42)
  other vias: 23.5,12.06
N$77  (via drill 0.7 pad 1.42)
  other vias: 27.3,12.06
N$78  (via drill 0.7 pad 1.42)
  other vias: 31.11,12.06
N$79  (via drill 0.7 pad 1.42)
  other vias: 31.11,22.23
N$80  (via drill 0.7 pad 1.42)
  other vias: 27.3,22.23
N$81  (via drill 0.7 pad 1.42)
  other vias: 23.5,22.23
N$82  (via drill 0.7 pad 1.42)
  other vias: 19.68,22.23
N$83  (via drill 0.7 pad 1.42)
  other vias: 15.88,22.23
N$84  (via drill 0.7 pad 1.42)
  other vias: 12.06,22.23
N$85  (via drill 0.7 pad 1.42)
  other vias: 8.26,22.23
N$86  (via drill 0.7 pad 1.42)
  other vias: 103.5,12.06
N$87  (via drill 0.7 pad 1.42)
  other vias: 107.31,12.06
N$88  (via drill 0.7 pad 1.42)
  other vias: 111.12,12.06
N$89  (via drill 0.7 pad 1.42)
  other vias: 114.94,12.06
N$90  (via drill 0.7 pad 1.42)
  other vias: 118.75,12.06
N$91  (via drill 0.7 pad 1.42)
  other vias: 122.56,12.06
N$92  (via drill 0.7 pad 1.42)
  other vias: 126.36,12.06
N$93  (via drill 0.7 pad 1.42)
  other vias: 71.75,22.23
N$94  (via drill 0.7 pad 1.42)
  other vias: 75.56,22.23
N$95  (via drill 0.7 pad 1.42)
  other vias: 79.38,22.23
N$96  (via drill 0.7 pad 1.42)
  other vias: 83.19,22.23
N$97  (via drill 0.7 pad 1.42)
  other vias: 87,22.23
N$98  (via drill 0.7 pad 1.42)
  other vias: 90.81,22.23
N$99  (via drill 0.7 pad 1.42)
  other vias: 94.61,22.23
N$100  (via drill 0.7 pad 1.42)
  other vias: 103.5,22.23
N$101  (via drill 0.7 pad 1.42)
  other vias: 107.31,22.23
N$102  (via drill 0.7 pad 1.42)
  other vias: 111.12,22.23
N$103  (via drill 0.7 pad 1.42)
  other vias: 114.94,22.23
N$104  (via drill 0.7 pad 1.42)
  other vias: 118.75,22.23
N$105  (via drill 0.7 pad 1.42)
  other vias: 122.56,22.23
N$106  (via drill 0.7 pad 1.42)
  other vias: 126.36,22.23
N$107  (via drill 0.7 pad 1.42)
  other vias: 15.24,36.83
N$108  (via drill 0.7 pad 1.42)
  other vias: 78.74,36.83
N$109  (via drill 0.7 pad 1.42)
  other vias: 46.99,36.83
N$110  (via drill 0.7 pad 1.42)
  other vias: 107.95,33.02
N$111  (via drill 0.7 pad 1.42)
  other vias: 132.08,36.83
N$113  (via drill 0.7 pad 1.42)
  other vias: 44.45,33.02
N$115  (via drill 0.7 pad 1.42)
  other vias: 76.83,36.83
N$116  (via drill 0.7 pad 1.42)
  other vias: 68.58,33.02
N$117  (via drill 0.7 pad 1.42)
  other vias: 76.2,33.02
N$118  (via drill 0.7 pad 1.42)
  other vias: 110.49,36.83
N$119  (via drill 0.7 pad 1.42)
  other vias: 108.58,36.83

### Text on the board
Bottom: serializer